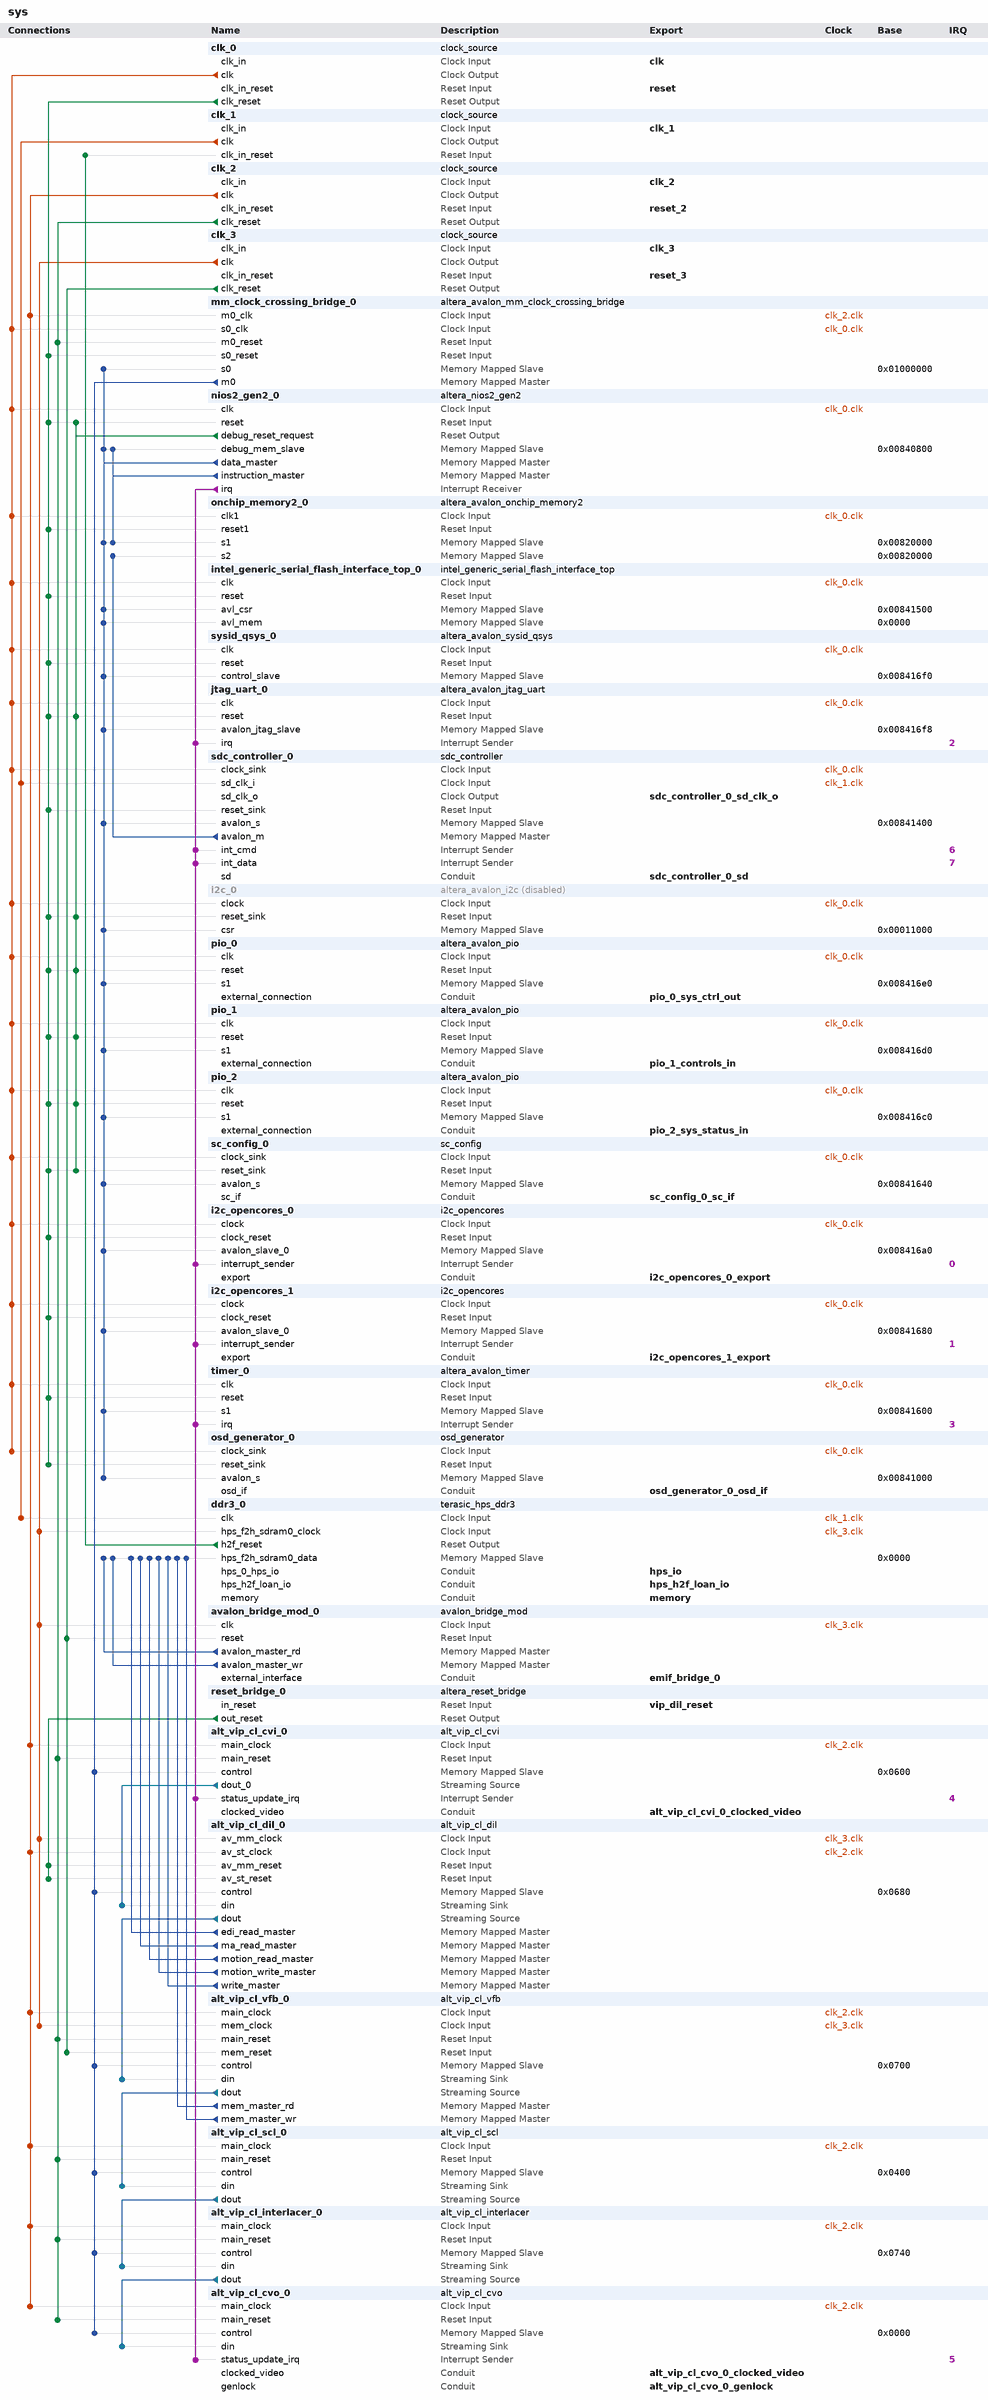
[diagram p0: system contents]
# Platform Designer (Qsys) system sys, Cyclone V 5CSEBA6U23I7
# Parameters at their usual value, and those the tool derives, are not listed.
package require -exact qsys 21.1
create_system sys
set_project_property DEVICE_FAMILY {Cyclone V}
set_project_property DEVICE 5CSEBA6U23I7

add_instance clk_0 clock_source 21.1
set_instance_parameter_value clk_0 clockFrequency 27000000

add_instance clk_1 clock_source 21.1
set_instance_parameter_value clk_1 clockFrequency 50000000

add_instance clk_2 clock_source 21.1
set_instance_parameter_value clk_2 clockFrequency 135000000

add_instance clk_3 clock_source 21.1
set_instance_parameter_value clk_3 clockFrequency 100000000

add_instance mm_clock_crossing_bridge_0 altera_avalon_mm_clock_crossing_bridge 21.1
set_instance_parameter_value mm_clock_crossing_bridge_0 ADDRESS_WIDTH 10
set_instance_parameter_value mm_clock_crossing_bridge_0 COMMAND_FIFO_DEPTH 4
set_instance_parameter_value mm_clock_crossing_bridge_0 DATA_WIDTH 32
set_instance_parameter_value mm_clock_crossing_bridge_0 MASTER_SYNC_DEPTH 2
set_instance_parameter_value mm_clock_crossing_bridge_0 MAX_BURST_SIZE 1
set_instance_parameter_value mm_clock_crossing_bridge_0 RESPONSE_FIFO_DEPTH 4
set_instance_parameter_value mm_clock_crossing_bridge_0 SLAVE_SYNC_DEPTH 2
set_instance_parameter_value mm_clock_crossing_bridge_0 USE_AUTO_ADDRESS_WIDTH 1

add_instance nios2_gen2_0 altera_nios2_gen2 21.1
set_instance_parameter_value nios2_gen2_0 dcache_size 2048
set_instance_parameter_value nios2_gen2_0 exceptionSlave onchip_memory2_0.s1
set_instance_parameter_value nios2_gen2_0 icache_size 4096
set_instance_parameter_value nios2_gen2_0 impl Tiny
set_instance_parameter_value nios2_gen2_0 resetSlave onchip_memory2_0.s1

add_instance onchip_memory2_0 altera_avalon_onchip_memory2 21.1
set_instance_parameter_value onchip_memory2_0 dataWidth 32
set_instance_parameter_value onchip_memory2_0 dualPort true
set_instance_parameter_value onchip_memory2_0 initMemContent true
set_instance_parameter_value onchip_memory2_0 initializationFileName onchip_mem.hex
set_instance_parameter_value onchip_memory2_0 memorySize 114688
set_instance_parameter_value onchip_memory2_0 singleClockOperation true

add_instance intel_generic_serial_flash_interface_top_0 intel_generic_serial_flash_interface_top 21.1
set_instance_parameter_value intel_generic_serial_flash_interface_top_0 CHIP_SELECT_BYPASS false
set_instance_parameter_value intel_generic_serial_flash_interface_top_0 CHIP_SELS 1
set_instance_parameter_value intel_generic_serial_flash_interface_top_0 DEBUG_OPTION 0
set_instance_parameter_value intel_generic_serial_flash_interface_top_0 DEFAULT_VALUE_REG_0 1
set_instance_parameter_value intel_generic_serial_flash_interface_top_0 DEFAULT_VALUE_REG_1 1
set_instance_parameter_value intel_generic_serial_flash_interface_top_0 DEFAULT_VALUE_REG_2 0
set_instance_parameter_value intel_generic_serial_flash_interface_top_0 DEFAULT_VALUE_REG_3 0
set_instance_parameter_value intel_generic_serial_flash_interface_top_0 DEFAULT_VALUE_REG_4 0
set_instance_parameter_value intel_generic_serial_flash_interface_top_0 DEFAULT_VALUE_REG_5 3
set_instance_parameter_value intel_generic_serial_flash_interface_top_0 DEFAULT_VALUE_REG_6 1282
set_instance_parameter_value intel_generic_serial_flash_interface_top_0 DEFAULT_VALUE_REG_7 6149
set_instance_parameter_value intel_generic_serial_flash_interface_top_0 DEVICE_DENSITY 64
set_instance_parameter_value intel_generic_serial_flash_interface_top_0 ENABLE_SIM_MODEL false
set_instance_parameter_value intel_generic_serial_flash_interface_top_0 PIPE_CMD_GEN_CMD 0
set_instance_parameter_value intel_generic_serial_flash_interface_top_0 PIPE_CSR 0
set_instance_parameter_value intel_generic_serial_flash_interface_top_0 PIPE_MUX_CMD 0
set_instance_parameter_value intel_generic_serial_flash_interface_top_0 PIPE_XIP 0
set_instance_parameter_value intel_generic_serial_flash_interface_top_0 USE_CHIP_SEL_FROM_CSR 1
set_instance_parameter_value intel_generic_serial_flash_interface_top_0 gui_use_asmiblock false
set_instance_parameter_value intel_generic_serial_flash_interface_top_0 gui_use_csr_byteenable false
set_instance_parameter_value intel_generic_serial_flash_interface_top_0 gui_use_gpio false

add_instance sysid_qsys_0 altera_avalon_sysid_qsys 21.1
set_instance_parameter_value sysid_qsys_0 id 291

add_instance jtag_uart_0 altera_avalon_jtag_uart 21.1
set_instance_parameter_value jtag_uart_0 simInteractiveOptions NO_INTERACTIVE_WINDOWS

add_instance sdc_controller_0 sdc_controller 1.0

add_instance i2c_0 altera_avalon_i2c 21.1
set_instance_property i2c_0 ENABLED false
set_instance_parameter_value i2c_0 FIFO_DEPTH 4

add_instance pio_0 altera_avalon_pio 21.1
set_instance_parameter_value pio_0 direction Output
set_instance_parameter_value pio_0 width 32

add_instance pio_1 altera_avalon_pio 21.1
set_instance_parameter_value pio_1 direction Input
set_instance_parameter_value pio_1 width 32

add_instance pio_2 altera_avalon_pio 21.1
set_instance_parameter_value pio_2 direction Input
set_instance_parameter_value pio_2 width 32

add_instance sc_config_0 sc_config 1.0

add_instance i2c_opencores_0 i2c_opencores 17.1
set_instance_parameter_value i2c_opencores_0 dedicated_spi 0

add_instance i2c_opencores_1 i2c_opencores 17.1
set_instance_parameter_value i2c_opencores_1 dedicated_spi 0

add_instance timer_0 altera_avalon_timer 21.1
set_instance_parameter_value timer_0 counterSize 64
set_instance_parameter_value timer_0 period 1
set_instance_parameter_value timer_0 periodUnits USEC

add_instance osd_generator_0 osd_generator 1.0

add_instance ddr3_0 terasic_hps_ddr3 1.0

add_instance avalon_bridge_mod_0 avalon_bridge_mod 1.0
set_instance_parameter_value avalon_bridge_mod_0 AW 32
set_instance_parameter_value avalon_bridge_mod_0 DW 256

add_instance reset_bridge_0 altera_reset_bridge 21.1
set_instance_parameter_value reset_bridge_0 ACTIVE_LOW_RESET 1
set_instance_parameter_value reset_bridge_0 SYNCHRONOUS_EDGES none

add_instance alt_vip_cl_cvi_0 alt_vip_cl_cvi 21.1
set_instance_parameter_value alt_vip_cl_cvi_0 ACCEPT_COLOURS_IN_SEQ 0
set_instance_parameter_value alt_vip_cl_cvi_0 ANC_DEPTH 1
set_instance_parameter_value alt_vip_cl_cvi_0 BPS 8
set_instance_parameter_value alt_vip_cl_cvi_0 CLOCKS_ARE_SAME 0
set_instance_parameter_value alt_vip_cl_cvi_0 COLOUR_PLANES_ARE_IN_PARALLEL 1
set_instance_parameter_value alt_vip_cl_cvi_0 EXTRACT_TOTAL_RESOLUTION 1
set_instance_parameter_value alt_vip_cl_cvi_0 FIFO_DEPTH 1024
set_instance_parameter_value alt_vip_cl_cvi_0 GENERATE_ANC 0
set_instance_parameter_value alt_vip_cl_cvi_0 GENERATE_VID_F 0
set_instance_parameter_value alt_vip_cl_cvi_0 H_ACTIVE_PIXELS_F0 1920
set_instance_parameter_value alt_vip_cl_cvi_0 INTERLACED 0
set_instance_parameter_value alt_vip_cl_cvi_0 MATCH_CTRLDATA_PKT_CLIP_BASIC 0
set_instance_parameter_value alt_vip_cl_cvi_0 MATCH_CTRLDATA_PKT_PAD_ADV 0
set_instance_parameter_value alt_vip_cl_cvi_0 NO_OF_CHANNELS 1
set_instance_parameter_value alt_vip_cl_cvi_0 NUMBER_OF_COLOUR_PLANES 3
set_instance_parameter_value alt_vip_cl_cvi_0 OVERFLOW_HANDLING 0
set_instance_parameter_value alt_vip_cl_cvi_0 PIXELS_IN_PARALLEL 2
set_instance_parameter_value alt_vip_cl_cvi_0 STD_WIDTH 1
set_instance_parameter_value alt_vip_cl_cvi_0 SYNC_TO 0
set_instance_parameter_value alt_vip_cl_cvi_0 USE_CONTROL 1
set_instance_parameter_value alt_vip_cl_cvi_0 USE_EMBEDDED_SYNCS 0
set_instance_parameter_value alt_vip_cl_cvi_0 USE_HDMI_DEPRICATION 0
set_instance_parameter_value alt_vip_cl_cvi_0 USE_STD 0
set_instance_parameter_value alt_vip_cl_cvi_0 V_ACTIVE_LINES_F0 1080
set_instance_parameter_value alt_vip_cl_cvi_0 V_ACTIVE_LINES_F1 480

add_instance alt_vip_cl_dil_0 alt_vip_cl_dil 21.1
set_instance_parameter_value alt_vip_cl_dil_0 BITS_PER_SYMBOL 8
set_instance_parameter_value alt_vip_cl_dil_0 BOB_BEHAVIOUR FRAME_FOR_FIELD
set_instance_parameter_value alt_vip_cl_dil_0 CADENCE_ALGORITHM_NAME CADENCE_32_22_VOF
set_instance_parameter_value alt_vip_cl_dil_0 CADENCE_DETECTION 0
set_instance_parameter_value alt_vip_cl_dil_0 CLOCKS_ARE_SEPARATE 1
set_instance_parameter_value alt_vip_cl_dil_0 COLOR_PLANES_ARE_IN_PARALLEL 1
set_instance_parameter_value alt_vip_cl_dil_0 DEINTERLACE_ALGORITHM MOTION_ADAPTIVE
set_instance_parameter_value alt_vip_cl_dil_0 DISABLE_EMBEDDED_STREAM_CLEANER 0
set_instance_parameter_value alt_vip_cl_dil_0 EDI_READ_MASTER_BURST_TARGET 32
set_instance_parameter_value alt_vip_cl_dil_0 EDI_READ_MASTER_FIFO_DEPTH 64
set_instance_parameter_value alt_vip_cl_dil_0 FAMILY {Cyclone V}
set_instance_parameter_value alt_vip_cl_dil_0 FIELD_LATENCY 0
set_instance_parameter_value alt_vip_cl_dil_0 INCOMING_VIDEO_IS_422 0
set_instance_parameter_value alt_vip_cl_dil_0 INCOMING_VIDEO_IS_YCBCR 0
set_instance_parameter_value alt_vip_cl_dil_0 MAX_HEIGHT 1080
set_instance_parameter_value alt_vip_cl_dil_0 MAX_SYMBOLS_PER_PACKET 10
set_instance_parameter_value alt_vip_cl_dil_0 MAX_WIDTH 2048
set_instance_parameter_value alt_vip_cl_dil_0 MA_READ_MASTER_BURST_TARGET 32
set_instance_parameter_value alt_vip_cl_dil_0 MA_READ_MASTER_FIFO_DEPTH 64
set_instance_parameter_value alt_vip_cl_dil_0 MEM_BASE_ADDR 134217728
set_instance_parameter_value alt_vip_cl_dil_0 MEM_PORT_WIDTH 256
set_instance_parameter_value alt_vip_cl_dil_0 MOTION_BLEED 1
set_instance_parameter_value alt_vip_cl_dil_0 MOTION_BPS 7
set_instance_parameter_value alt_vip_cl_dil_0 MOTION_READ_MASTER_BURST_TARGET 32
set_instance_parameter_value alt_vip_cl_dil_0 MOTION_READ_MASTER_FIFO_DEPTH 64
set_instance_parameter_value alt_vip_cl_dil_0 MOTION_WRITE_MASTER_BURST_TARGET 32
set_instance_parameter_value alt_vip_cl_dil_0 MOTION_WRITE_MASTER_FIFO_DEPTH 64
set_instance_parameter_value alt_vip_cl_dil_0 NUMBER_OF_COLOR_PLANES 3
set_instance_parameter_value alt_vip_cl_dil_0 PIXELS_IN_PARALLEL 2
set_instance_parameter_value alt_vip_cl_dil_0 RUNTIME_CONTROL 1
set_instance_parameter_value alt_vip_cl_dil_0 SWAP_F0_F1 0
set_instance_parameter_value alt_vip_cl_dil_0 USER_PACKETS_MAX_STORAGE 0
set_instance_parameter_value alt_vip_cl_dil_0 USER_PACKET_FIFO_DEPTH 0
set_instance_parameter_value alt_vip_cl_dil_0 USER_PACKET_SUPPORT PASSTHROUGH
set_instance_parameter_value alt_vip_cl_dil_0 WRITE_MASTER_BURST_TARGET 32
set_instance_parameter_value alt_vip_cl_dil_0 WRITE_MASTER_FIFO_DEPTH 64

add_instance alt_vip_cl_vfb_0 alt_vip_cl_vfb 21.1
set_instance_parameter_value alt_vip_cl_vfb_0 CLOCKS_ARE_SEPARATE 1
set_instance_parameter_value alt_vip_cl_vfb_0 CONTROLLED_DROP_REPEAT 1
set_instance_parameter_value alt_vip_cl_vfb_0 DROP_FRAMES 1
set_instance_parameter_value alt_vip_cl_vfb_0 DROP_INVALID_FIELDS 1
set_instance_parameter_value alt_vip_cl_vfb_0 DROP_REPEAT_USER 0
set_instance_parameter_value alt_vip_cl_vfb_0 IS_FRAME_READER 0
set_instance_parameter_value alt_vip_cl_vfb_0 LINE_BASED_BUFFERING 0
set_instance_parameter_value alt_vip_cl_vfb_0 MAX_HEIGHT 1440
set_instance_parameter_value alt_vip_cl_vfb_0 MAX_WIDTH 2048
set_instance_parameter_value alt_vip_cl_vfb_0 MEM_BASE_ADDR 268435456
set_instance_parameter_value alt_vip_cl_vfb_0 MEM_BUFFER_OFFSET 134217728
set_instance_parameter_value alt_vip_cl_vfb_0 MEM_PORT_WIDTH 256
set_instance_parameter_value alt_vip_cl_vfb_0 PIXELS_IN_PARALLEL 2
set_instance_parameter_value alt_vip_cl_vfb_0 PRIORITIZE_FMAX 0
set_instance_parameter_value alt_vip_cl_vfb_0 READER_RUNTIME_CONTROL 0
set_instance_parameter_value alt_vip_cl_vfb_0 READ_FIFO_DEPTH 64
set_instance_parameter_value alt_vip_cl_vfb_0 USER_PACKETS_MAX_STORAGE 0
set_instance_parameter_value alt_vip_cl_vfb_0 USE_BUFFER_OFFSET 1
set_instance_parameter_value alt_vip_cl_vfb_0 WRITER_RUNTIME_CONTROL 1
set_instance_parameter_value alt_vip_cl_vfb_0 WRITE_BURST_TARGET 32
set_instance_parameter_value alt_vip_cl_vfb_0 WRITE_FIFO_DEPTH 64

add_instance alt_vip_cl_scl_0 alt_vip_cl_scl 21.1
set_instance_parameter_value alt_vip_cl_scl_0 ALGORITHM_NAME EDGE_ADAPT
set_instance_parameter_value alt_vip_cl_scl_0 ALWAYS_DOWNSCALE 0
set_instance_parameter_value alt_vip_cl_scl_0 ARE_IDENTICAL 0
set_instance_parameter_value alt_vip_cl_scl_0 BITS_PER_SYMBOL 8
set_instance_parameter_value alt_vip_cl_scl_0 DEFAULT_EDGE_THRESH 7
set_instance_parameter_value alt_vip_cl_scl_0 DEFAULT_LOWER_BLUR 0
set_instance_parameter_value alt_vip_cl_scl_0 DEFAULT_UPPER_BLUR 0
set_instance_parameter_value alt_vip_cl_scl_0 ENABLE_FIR 0
set_instance_parameter_value alt_vip_cl_scl_0 EXTRA_PIPELINING 0
set_instance_parameter_value alt_vip_cl_scl_0 FAMILY {Cyclone V}
set_instance_parameter_value alt_vip_cl_scl_0 H_BANKS 1
set_instance_parameter_value alt_vip_cl_scl_0 H_COEFF_FILE {<enter file name (including full path)>}
set_instance_parameter_value alt_vip_cl_scl_0 H_FRACTION_BITS 7
set_instance_parameter_value alt_vip_cl_scl_0 H_FUNCTION LANCZOS_2
set_instance_parameter_value alt_vip_cl_scl_0 H_INTEGER_BITS 1
set_instance_parameter_value alt_vip_cl_scl_0 H_PHASES 64
set_instance_parameter_value alt_vip_cl_scl_0 H_SIGNED 1
set_instance_parameter_value alt_vip_cl_scl_0 H_SYMMETRIC 0
set_instance_parameter_value alt_vip_cl_scl_0 H_TAPS 4
set_instance_parameter_value alt_vip_cl_scl_0 IS_420 0
set_instance_parameter_value alt_vip_cl_scl_0 IS_422 0
set_instance_parameter_value alt_vip_cl_scl_0 LIMITED_READBACK 1
set_instance_parameter_value alt_vip_cl_scl_0 LOAD_AT_RUNTIME 1
set_instance_parameter_value alt_vip_cl_scl_0 MAX_IN_HEIGHT 1440
set_instance_parameter_value alt_vip_cl_scl_0 MAX_IN_WIDTH 2048
set_instance_parameter_value alt_vip_cl_scl_0 MAX_OUT_HEIGHT 1440
set_instance_parameter_value alt_vip_cl_scl_0 MAX_OUT_WIDTH 2560
set_instance_parameter_value alt_vip_cl_scl_0 NO_BLANKING 0
set_instance_parameter_value alt_vip_cl_scl_0 PIXELS_IN_PARALLEL 2
set_instance_parameter_value alt_vip_cl_scl_0 PRESERVE_BITS 0
set_instance_parameter_value alt_vip_cl_scl_0 RUNTIME_CONTROL 1
set_instance_parameter_value alt_vip_cl_scl_0 SYMBOLS_IN_PAR 3
set_instance_parameter_value alt_vip_cl_scl_0 SYMBOLS_IN_SEQ 1
set_instance_parameter_value alt_vip_cl_scl_0 USER_PACKET_FIFO_DEPTH 0
set_instance_parameter_value alt_vip_cl_scl_0 USER_PACKET_SUPPORT PASSTHROUGH
set_instance_parameter_value alt_vip_cl_scl_0 V_BANKS 1
set_instance_parameter_value alt_vip_cl_scl_0 V_COEFF_FILE {<enter file name (including full path)>}
set_instance_parameter_value alt_vip_cl_scl_0 V_FRACTION_BITS 7
set_instance_parameter_value alt_vip_cl_scl_0 V_FUNCTION LANCZOS_2
set_instance_parameter_value alt_vip_cl_scl_0 V_INTEGER_BITS 1
set_instance_parameter_value alt_vip_cl_scl_0 V_PHASES 64
set_instance_parameter_value alt_vip_cl_scl_0 V_SIGNED 1
set_instance_parameter_value alt_vip_cl_scl_0 V_SYMMETRIC 0
set_instance_parameter_value alt_vip_cl_scl_0 V_TAPS 4

add_instance alt_vip_cl_interlacer_0 alt_vip_cl_interlacer 21.1
set_instance_parameter_value alt_vip_cl_interlacer_0 BITS_PER_SYMBOL 8
set_instance_parameter_value alt_vip_cl_interlacer_0 COLOR_PLANES_ARE_IN_PARALLEL 1
set_instance_parameter_value alt_vip_cl_interlacer_0 CTRL_OVERRIDE 1
set_instance_parameter_value alt_vip_cl_interlacer_0 EXTRA_PIPELINING 0
set_instance_parameter_value alt_vip_cl_interlacer_0 INTERLACE_PASSTHROUGH 0
set_instance_parameter_value alt_vip_cl_interlacer_0 LIMITED_READBACK 1
set_instance_parameter_value alt_vip_cl_interlacer_0 MAX_HEIGHT 1440
set_instance_parameter_value alt_vip_cl_interlacer_0 MAX_WIDTH 2560
set_instance_parameter_value alt_vip_cl_interlacer_0 NUMBER_OF_COLOR_PLANES 3
set_instance_parameter_value alt_vip_cl_interlacer_0 PIXELS_IN_PARALLEL 2
set_instance_parameter_value alt_vip_cl_interlacer_0 RUNTIME_CONTROL 1
set_instance_parameter_value alt_vip_cl_interlacer_0 SEND_F1_FIRST 0

add_instance alt_vip_cl_cvo_0 alt_vip_cl_cvo 21.1
set_instance_parameter_value alt_vip_cl_cvo_0 ACCEPT_COLOURS_IN_SEQ 0
set_instance_parameter_value alt_vip_cl_cvo_0 ACCEPT_SYNC 1
set_instance_parameter_value alt_vip_cl_cvo_0 ANC_LINE 0
set_instance_parameter_value alt_vip_cl_cvo_0 AP_LINE 0
set_instance_parameter_value alt_vip_cl_cvo_0 BPS 8
set_instance_parameter_value alt_vip_cl_cvo_0 CLOCKS_ARE_SAME 0
set_instance_parameter_value alt_vip_cl_cvo_0 COLOUR_PLANES_ARE_IN_PARALLEL 1
set_instance_parameter_value alt_vip_cl_cvo_0 CONTEXT_WIDTH 8
set_instance_parameter_value alt_vip_cl_cvo_0 COUNT_STEP_IS_PIP_VALUE 0
set_instance_parameter_value alt_vip_cl_cvo_0 DST_WIDTH 8
set_instance_parameter_value alt_vip_cl_cvo_0 FIELD0_ANC_LINE 0
set_instance_parameter_value alt_vip_cl_cvo_0 FIELD0_V_BACK_PORCH 0
set_instance_parameter_value alt_vip_cl_cvo_0 FIELD0_V_BLANK 0
set_instance_parameter_value alt_vip_cl_cvo_0 FIELD0_V_FRONT_PORCH 0
set_instance_parameter_value alt_vip_cl_cvo_0 FIELD0_V_RISING_EDGE 0
set_instance_parameter_value alt_vip_cl_cvo_0 FIELD0_V_SYNC_LENGTH 0
set_instance_parameter_value alt_vip_cl_cvo_0 FIFO_DEPTH 1024
set_instance_parameter_value alt_vip_cl_cvo_0 F_FALLING_EDGE 0
set_instance_parameter_value alt_vip_cl_cvo_0 F_RISING_EDGE 0
set_instance_parameter_value alt_vip_cl_cvo_0 GENERATE_SYNC 1
set_instance_parameter_value alt_vip_cl_cvo_0 H_ACTIVE_PIXELS 1920
set_instance_parameter_value alt_vip_cl_cvo_0 H_BACK_PORCH 148
set_instance_parameter_value alt_vip_cl_cvo_0 H_BLANK 0
set_instance_parameter_value alt_vip_cl_cvo_0 H_FRONT_PORCH 88
set_instance_parameter_value alt_vip_cl_cvo_0 H_SYNC_LENGTH 44
set_instance_parameter_value alt_vip_cl_cvo_0 INTERLACED 0
set_instance_parameter_value alt_vip_cl_cvo_0 LOW_LATENCY 1
set_instance_parameter_value alt_vip_cl_cvo_0 NO_OF_CHANNELS 1
set_instance_parameter_value alt_vip_cl_cvo_0 NO_OF_MODES 1
set_instance_parameter_value alt_vip_cl_cvo_0 NUMBER_OF_COLOUR_PLANES 3
set_instance_parameter_value alt_vip_cl_cvo_0 PIXELS_IN_PARALLEL 2
set_instance_parameter_value alt_vip_cl_cvo_0 SRC_WIDTH 8
set_instance_parameter_value alt_vip_cl_cvo_0 STD_WIDTH 1
set_instance_parameter_value alt_vip_cl_cvo_0 TASK_WIDTH 8
set_instance_parameter_value alt_vip_cl_cvo_0 THRESHOLD 1023
set_instance_parameter_value alt_vip_cl_cvo_0 USE_CONTROL 1
set_instance_parameter_value alt_vip_cl_cvo_0 USE_EMBEDDED_SYNCS 0
set_instance_parameter_value alt_vip_cl_cvo_0 V_ACTIVE_LINES 1200
set_instance_parameter_value alt_vip_cl_cvo_0 V_BACK_PORCH 36
set_instance_parameter_value alt_vip_cl_cvo_0 V_BLANK 0
set_instance_parameter_value alt_vip_cl_cvo_0 V_FRONT_PORCH 4
set_instance_parameter_value alt_vip_cl_cvo_0 V_SYNC_LENGTH 5

# connections
add_connection clk_0.clk i2c_0.clock clock
add_connection clk_0.clk i2c_opencores_0.clock clock
add_connection clk_0.clk i2c_opencores_1.clock clock
add_connection clk_0.clk intel_generic_serial_flash_interface_top_0.clk clock
add_connection clk_0.clk jtag_uart_0.clk clock
add_connection clk_0.clk mm_clock_crossing_bridge_0.s0_clk clock
add_connection clk_0.clk nios2_gen2_0.clk clock
add_connection clk_0.clk onchip_memory2_0.clk1 clock
add_connection clk_0.clk osd_generator_0.clock_sink clock
add_connection clk_0.clk pio_0.clk clock
add_connection clk_0.clk pio_1.clk clock
add_connection clk_0.clk pio_2.clk clock
add_connection clk_0.clk sc_config_0.clock_sink clock
add_connection clk_0.clk sdc_controller_0.clock_sink clock
add_connection clk_0.clk sysid_qsys_0.clk clock
add_connection clk_0.clk timer_0.clk clock
add_connection clk_1.clk ddr3_0.clk clock
add_connection clk_1.clk sdc_controller_0.sd_clk_i clock
add_connection clk_2.clk alt_vip_cl_cvi_0.main_clock clock
add_connection clk_2.clk alt_vip_cl_cvo_0.main_clock clock
add_connection clk_2.clk alt_vip_cl_dil_0.av_st_clock clock
add_connection clk_2.clk alt_vip_cl_interlacer_0.main_clock clock
add_connection clk_2.clk alt_vip_cl_scl_0.main_clock clock
add_connection clk_2.clk alt_vip_cl_vfb_0.main_clock clock
add_connection clk_2.clk mm_clock_crossing_bridge_0.m0_clk clock
add_connection clk_3.clk alt_vip_cl_dil_0.av_mm_clock clock
add_connection clk_3.clk alt_vip_cl_vfb_0.mem_clock clock
add_connection clk_3.clk avalon_bridge_mod_0.clk clock
add_connection clk_3.clk ddr3_0.hps_f2h_sdram0_clock clock
add_connection clk_0.clk_reset i2c_0.reset_sink reset
add_connection clk_0.clk_reset i2c_opencores_0.clock_reset reset
add_connection clk_0.clk_reset i2c_opencores_1.clock_reset reset
add_connection clk_0.clk_reset intel_generic_serial_flash_interface_top_0.reset reset
add_connection clk_0.clk_reset jtag_uart_0.reset reset
add_connection clk_0.clk_reset mm_clock_crossing_bridge_0.s0_reset reset
add_connection clk_0.clk_reset nios2_gen2_0.reset reset
add_connection clk_0.clk_reset onchip_memory2_0.reset1 reset
add_connection clk_0.clk_reset osd_generator_0.reset_sink reset
add_connection clk_0.clk_reset pio_0.reset reset
add_connection clk_0.clk_reset pio_1.reset reset
add_connection clk_0.clk_reset pio_2.reset reset
add_connection clk_0.clk_reset sc_config_0.reset_sink reset
add_connection clk_0.clk_reset sdc_controller_0.reset_sink reset
add_connection clk_0.clk_reset sysid_qsys_0.reset reset
add_connection clk_0.clk_reset timer_0.reset reset
add_connection clk_2.clk_reset alt_vip_cl_cvi_0.main_reset reset
add_connection clk_2.clk_reset alt_vip_cl_cvo_0.main_reset reset
add_connection clk_2.clk_reset alt_vip_cl_interlacer_0.main_reset reset
add_connection clk_2.clk_reset alt_vip_cl_scl_0.main_reset reset
add_connection clk_2.clk_reset alt_vip_cl_vfb_0.main_reset reset
add_connection clk_2.clk_reset mm_clock_crossing_bridge_0.m0_reset reset
add_connection clk_3.clk_reset alt_vip_cl_vfb_0.mem_reset reset
add_connection clk_3.clk_reset avalon_bridge_mod_0.reset reset
add_connection ddr3_0.h2f_reset clk_1.clk_in_reset reset
add_connection nios2_gen2_0.debug_reset_request i2c_0.reset_sink reset
add_connection nios2_gen2_0.debug_reset_request jtag_uart_0.reset reset
add_connection nios2_gen2_0.debug_reset_request nios2_gen2_0.reset reset
add_connection nios2_gen2_0.debug_reset_request pio_0.reset reset
add_connection nios2_gen2_0.debug_reset_request pio_1.reset reset
add_connection nios2_gen2_0.debug_reset_request pio_2.reset reset
add_connection nios2_gen2_0.debug_reset_request sc_config_0.reset_sink reset
add_connection reset_bridge_0.out_reset alt_vip_cl_dil_0.av_mm_reset reset
add_connection reset_bridge_0.out_reset alt_vip_cl_dil_0.av_st_reset reset
add_connection alt_vip_cl_dil_0.edi_read_master ddr3_0.hps_f2h_sdram0_data avalon
set_connection_parameter_value alt_vip_cl_dil_0.edi_read_master/ddr3_0.hps_f2h_sdram0_data baseAddress 0x0000
add_connection alt_vip_cl_dil_0.ma_read_master ddr3_0.hps_f2h_sdram0_data avalon
set_connection_parameter_value alt_vip_cl_dil_0.ma_read_master/ddr3_0.hps_f2h_sdram0_data baseAddress 0x0000
add_connection alt_vip_cl_dil_0.motion_read_master ddr3_0.hps_f2h_sdram0_data avalon
set_connection_parameter_value alt_vip_cl_dil_0.motion_read_master/ddr3_0.hps_f2h_sdram0_data baseAddress 0x0000
add_connection alt_vip_cl_dil_0.motion_write_master ddr3_0.hps_f2h_sdram0_data avalon
set_connection_parameter_value alt_vip_cl_dil_0.motion_write_master/ddr3_0.hps_f2h_sdram0_data baseAddress 0x0000
add_connection alt_vip_cl_dil_0.write_master ddr3_0.hps_f2h_sdram0_data avalon
set_connection_parameter_value alt_vip_cl_dil_0.write_master/ddr3_0.hps_f2h_sdram0_data baseAddress 0x0000
add_connection alt_vip_cl_vfb_0.mem_master_rd ddr3_0.hps_f2h_sdram0_data avalon
set_connection_parameter_value alt_vip_cl_vfb_0.mem_master_rd/ddr3_0.hps_f2h_sdram0_data baseAddress 0x0000
add_connection alt_vip_cl_vfb_0.mem_master_wr ddr3_0.hps_f2h_sdram0_data avalon
set_connection_parameter_value alt_vip_cl_vfb_0.mem_master_wr/ddr3_0.hps_f2h_sdram0_data baseAddress 0x0000
add_connection avalon_bridge_mod_0.avalon_master_rd ddr3_0.hps_f2h_sdram0_data avalon
set_connection_parameter_value avalon_bridge_mod_0.avalon_master_rd/ddr3_0.hps_f2h_sdram0_data baseAddress 0x0000
add_connection avalon_bridge_mod_0.avalon_master_wr ddr3_0.hps_f2h_sdram0_data avalon
set_connection_parameter_value avalon_bridge_mod_0.avalon_master_wr/ddr3_0.hps_f2h_sdram0_data baseAddress 0x0000
add_connection mm_clock_crossing_bridge_0.m0 alt_vip_cl_cvi_0.control avalon
set_connection_parameter_value mm_clock_crossing_bridge_0.m0/alt_vip_cl_cvi_0.control baseAddress 0x0600
add_connection mm_clock_crossing_bridge_0.m0 alt_vip_cl_cvo_0.control avalon
set_connection_parameter_value mm_clock_crossing_bridge_0.m0/alt_vip_cl_cvo_0.control baseAddress 0x0000
add_connection mm_clock_crossing_bridge_0.m0 alt_vip_cl_dil_0.control avalon
set_connection_parameter_value mm_clock_crossing_bridge_0.m0/alt_vip_cl_dil_0.control baseAddress 0x0680
add_connection mm_clock_crossing_bridge_0.m0 alt_vip_cl_interlacer_0.control avalon
set_connection_parameter_value mm_clock_crossing_bridge_0.m0/alt_vip_cl_interlacer_0.control baseAddress 0x0740
add_connection mm_clock_crossing_bridge_0.m0 alt_vip_cl_scl_0.control avalon
set_connection_parameter_value mm_clock_crossing_bridge_0.m0/alt_vip_cl_scl_0.control baseAddress 0x0400
add_connection mm_clock_crossing_bridge_0.m0 alt_vip_cl_vfb_0.control avalon
set_connection_parameter_value mm_clock_crossing_bridge_0.m0/alt_vip_cl_vfb_0.control baseAddress 0x0700
add_connection nios2_gen2_0.data_master i2c_0.csr avalon
set_connection_parameter_value nios2_gen2_0.data_master/i2c_0.csr baseAddress 0x00011000
add_connection nios2_gen2_0.data_master i2c_opencores_0.avalon_slave_0 avalon
set_connection_parameter_value nios2_gen2_0.data_master/i2c_opencores_0.avalon_slave_0 baseAddress 0x008416a0
add_connection nios2_gen2_0.data_master i2c_opencores_1.avalon_slave_0 avalon
set_connection_parameter_value nios2_gen2_0.data_master/i2c_opencores_1.avalon_slave_0 baseAddress 0x00841680
add_connection nios2_gen2_0.data_master intel_generic_serial_flash_interface_top_0.avl_csr avalon
set_connection_parameter_value nios2_gen2_0.data_master/intel_generic_serial_flash_interface_top_0.avl_csr baseAddress 0x00841500
add_connection nios2_gen2_0.data_master intel_generic_serial_flash_interface_top_0.avl_mem avalon
set_connection_parameter_value nios2_gen2_0.data_master/intel_generic_serial_flash_interface_top_0.avl_mem baseAddress 0x0000
add_connection nios2_gen2_0.data_master jtag_uart_0.avalon_jtag_slave avalon
set_connection_parameter_value nios2_gen2_0.data_master/jtag_uart_0.avalon_jtag_slave baseAddress 0x008416f8
add_connection nios2_gen2_0.data_master mm_clock_crossing_bridge_0.s0 avalon
set_connection_parameter_value nios2_gen2_0.data_master/mm_clock_crossing_bridge_0.s0 baseAddress 0x01000000
add_connection nios2_gen2_0.data_master nios2_gen2_0.debug_mem_slave avalon
set_connection_parameter_value nios2_gen2_0.data_master/nios2_gen2_0.debug_mem_slave baseAddress 0x00840800
add_connection nios2_gen2_0.data_master onchip_memory2_0.s1 avalon
set_connection_parameter_value nios2_gen2_0.data_master/onchip_memory2_0.s1 baseAddress 0x00820000
add_connection nios2_gen2_0.data_master osd_generator_0.avalon_s avalon
set_connection_parameter_value nios2_gen2_0.data_master/osd_generator_0.avalon_s baseAddress 0x00841000
add_connection nios2_gen2_0.data_master pio_0.s1 avalon
set_connection_parameter_value nios2_gen2_0.data_master/pio_0.s1 baseAddress 0x008416e0
add_connection nios2_gen2_0.data_master pio_1.s1 avalon
set_connection_parameter_value nios2_gen2_0.data_master/pio_1.s1 baseAddress 0x008416d0
add_connection nios2_gen2_0.data_master pio_2.s1 avalon
set_connection_parameter_value nios2_gen2_0.data_master/pio_2.s1 baseAddress 0x008416c0
add_connection nios2_gen2_0.data_master sc_config_0.avalon_s avalon
set_connection_parameter_value nios2_gen2_0.data_master/sc_config_0.avalon_s baseAddress 0x00841640
add_connection nios2_gen2_0.data_master sdc_controller_0.avalon_s avalon
set_connection_parameter_value nios2_gen2_0.data_master/sdc_controller_0.avalon_s baseAddress 0x00841400
add_connection nios2_gen2_0.data_master sysid_qsys_0.control_slave avalon
set_connection_parameter_value nios2_gen2_0.data_master/sysid_qsys_0.control_slave baseAddress 0x008416f0
add_connection nios2_gen2_0.data_master timer_0.s1 avalon
set_connection_parameter_value nios2_gen2_0.data_master/timer_0.s1 baseAddress 0x00841600
add_connection nios2_gen2_0.instruction_master nios2_gen2_0.debug_mem_slave avalon
set_connection_parameter_value nios2_gen2_0.instruction_master/nios2_gen2_0.debug_mem_slave baseAddress 0x00840800
add_connection nios2_gen2_0.instruction_master onchip_memory2_0.s1 avalon
set_connection_parameter_value nios2_gen2_0.instruction_master/onchip_memory2_0.s1 baseAddress 0x00820000
add_connection sdc_controller_0.avalon_m onchip_memory2_0.s2 avalon
set_connection_parameter_value sdc_controller_0.avalon_m/onchip_memory2_0.s2 baseAddress 0x00820000
add_connection alt_vip_cl_cvi_0.dout_0 alt_vip_cl_dil_0.din avalon_streaming
add_connection alt_vip_cl_dil_0.dout alt_vip_cl_vfb_0.din avalon_streaming
add_connection alt_vip_cl_interlacer_0.dout alt_vip_cl_cvo_0.din avalon_streaming
add_connection alt_vip_cl_scl_0.dout alt_vip_cl_interlacer_0.din avalon_streaming
add_connection alt_vip_cl_vfb_0.dout alt_vip_cl_scl_0.din avalon_streaming
add_connection nios2_gen2_0.irq alt_vip_cl_cvi_0.status_update_irq interrupt
set_connection_parameter_value nios2_gen2_0.irq/alt_vip_cl_cvi_0.status_update_irq irqNumber 4
add_connection nios2_gen2_0.irq alt_vip_cl_cvo_0.status_update_irq interrupt
set_connection_parameter_value nios2_gen2_0.irq/alt_vip_cl_cvo_0.status_update_irq irqNumber 5
add_connection nios2_gen2_0.irq i2c_opencores_0.interrupt_sender interrupt
set_connection_parameter_value nios2_gen2_0.irq/i2c_opencores_0.interrupt_sender irqNumber 0
add_connection nios2_gen2_0.irq i2c_opencores_1.interrupt_sender interrupt
set_connection_parameter_value nios2_gen2_0.irq/i2c_opencores_1.interrupt_sender irqNumber 1
add_connection nios2_gen2_0.irq jtag_uart_0.irq interrupt
set_connection_parameter_value nios2_gen2_0.irq/jtag_uart_0.irq irqNumber 2
add_connection nios2_gen2_0.irq sdc_controller_0.int_cmd interrupt
set_connection_parameter_value nios2_gen2_0.irq/sdc_controller_0.int_cmd irqNumber 6
add_connection nios2_gen2_0.irq sdc_controller_0.int_data interrupt
set_connection_parameter_value nios2_gen2_0.irq/sdc_controller_0.int_data irqNumber 7
add_connection nios2_gen2_0.irq timer_0.irq interrupt
set_connection_parameter_value nios2_gen2_0.irq/timer_0.irq irqNumber 3

# exported interfaces
add_interface alt_vip_cl_cvi_0_clocked_video conduit end
set_interface_property alt_vip_cl_cvi_0_clocked_video EXPORT_OF alt_vip_cl_cvi_0.clocked_video
add_interface alt_vip_cl_cvo_0_clocked_video conduit end
set_interface_property alt_vip_cl_cvo_0_clocked_video EXPORT_OF alt_vip_cl_cvo_0.clocked_video
add_interface alt_vip_cl_cvo_0_genlock conduit end
set_interface_property alt_vip_cl_cvo_0_genlock EXPORT_OF alt_vip_cl_cvo_0.genlock
add_interface clk clock sink
set_interface_property clk EXPORT_OF clk_0.clk_in
add_interface clk_1 clock sink
set_interface_property clk_1 EXPORT_OF clk_1.clk_in
add_interface clk_2 clock sink
set_interface_property clk_2 EXPORT_OF clk_2.clk_in
add_interface clk_3 clock sink
set_interface_property clk_3 EXPORT_OF clk_3.clk_in
add_interface emif_bridge_0 conduit end
set_interface_property emif_bridge_0 EXPORT_OF avalon_bridge_mod_0.external_interface
add_interface hps_h2f_loan_io conduit end
set_interface_property hps_h2f_loan_io EXPORT_OF ddr3_0.hps_h2f_loan_io
add_interface hps_io conduit end
set_interface_property hps_io EXPORT_OF ddr3_0.hps_0_hps_io
add_interface i2c_opencores_0_export conduit end
set_interface_property i2c_opencores_0_export EXPORT_OF i2c_opencores_0.export
add_interface i2c_opencores_1_export conduit end
set_interface_property i2c_opencores_1_export EXPORT_OF i2c_opencores_1.export
add_interface memory conduit end
set_interface_property memory EXPORT_OF ddr3_0.memory
add_interface osd_generator_0_osd_if conduit end
set_interface_property osd_generator_0_osd_if EXPORT_OF osd_generator_0.osd_if
add_interface pio_0_sys_ctrl_out conduit end
set_interface_property pio_0_sys_ctrl_out EXPORT_OF pio_0.external_connection
add_interface pio_1_controls_in conduit end
set_interface_property pio_1_controls_in EXPORT_OF pio_1.external_connection
add_interface pio_2_sys_status_in conduit end
set_interface_property pio_2_sys_status_in EXPORT_OF pio_2.external_connection
add_interface reset reset sink
set_interface_property reset EXPORT_OF clk_0.clk_in_reset
add_interface reset_2 reset sink
set_interface_property reset_2 EXPORT_OF clk_2.clk_in_reset
add_interface reset_3 reset sink
set_interface_property reset_3 EXPORT_OF clk_3.clk_in_reset
add_interface sc_config_0_sc_if conduit end
set_interface_property sc_config_0_sc_if EXPORT_OF sc_config_0.sc_if
add_interface sdc_controller_0_sd conduit end
set_interface_property sdc_controller_0_sd EXPORT_OF sdc_controller_0.sd
add_interface sdc_controller_0_sd_clk_o clock source
set_interface_property sdc_controller_0_sd_clk_o EXPORT_OF sdc_controller_0.sd_clk_o
add_interface vip_dil_reset reset sink
set_interface_property vip_dil_reset EXPORT_OF reset_bridge_0.in_reset

set_interconnect_requirement {$system} qsys_mm.clockCrossingAdapter HANDSHAKE
set_interconnect_requirement {$system} qsys_mm.enableEccProtection FALSE
set_interconnect_requirement {$system} qsys_mm.insertDefaultSlave FALSE
set_interconnect_requirement {$system} qsys_mm.maxAdditionalLatency 1

save_system sys.qsys
